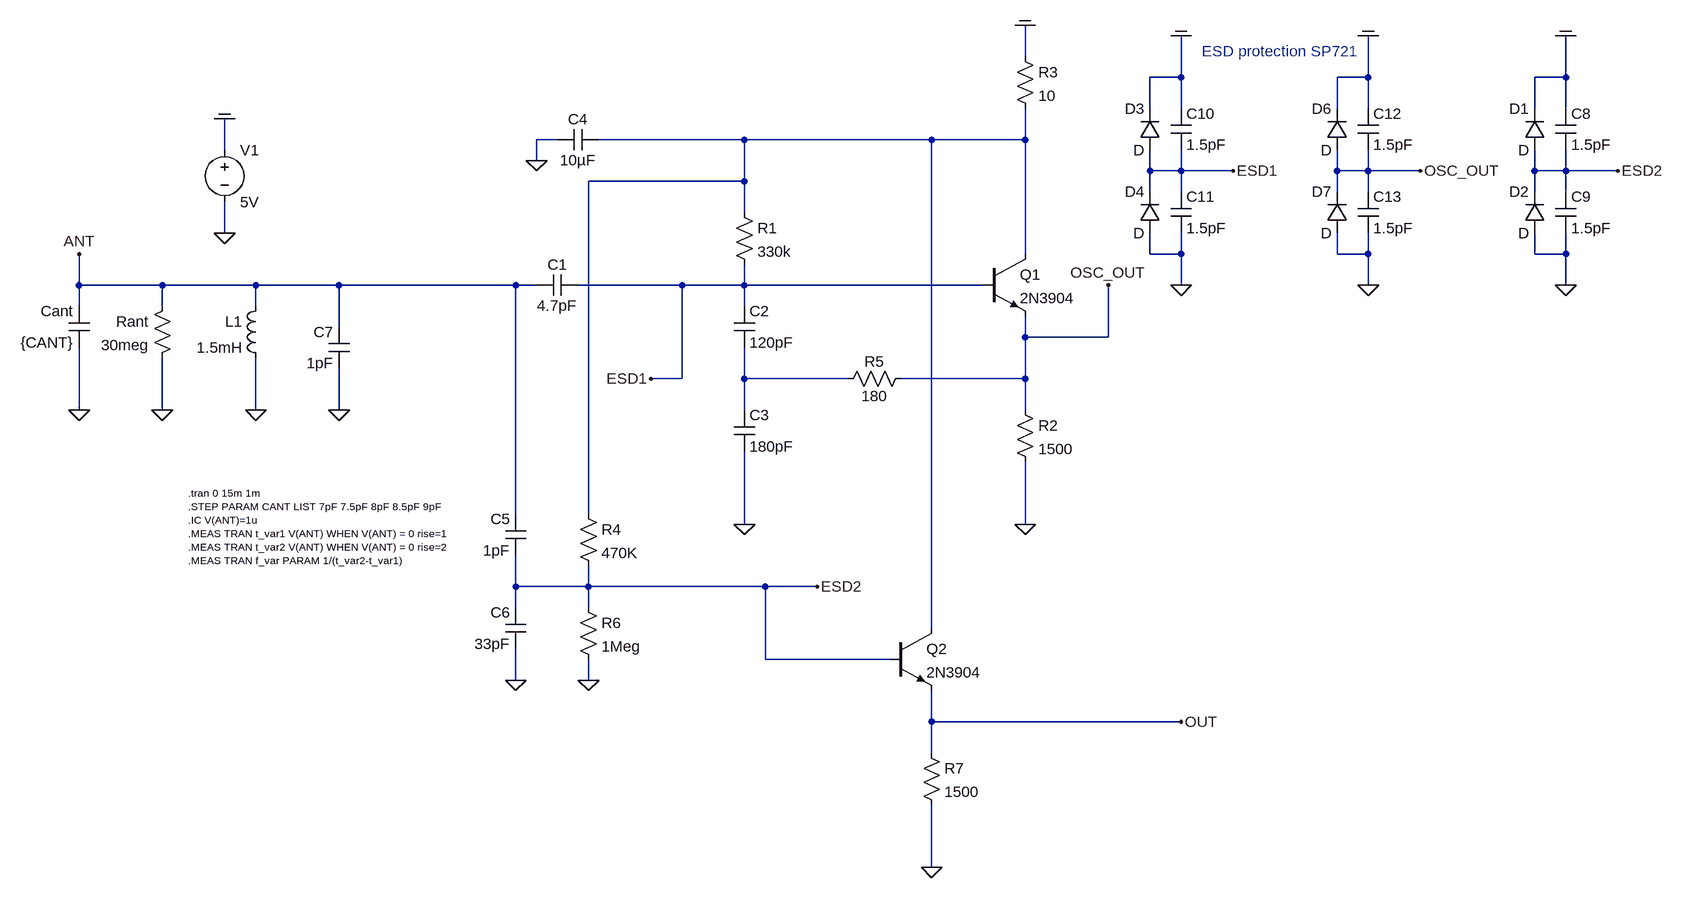
[diagram p0: schematic 2019_analog_oscill_sin_33v_v02.asc]
2019_analog_oscill_sin_33v_v02.asc, the LTspice schematic file:
Version 4
SHEET 1 2908 1508
WIRE 704 -160 704 -208
WIRE 944 -128 944 -192
WIRE 944 -128 896 -128
WIRE 1232 -128 1232 -192
WIRE 1232 -128 1184 -128
WIRE 1536 -128 1536 -192
WIRE 1536 -128 1488 -128
WIRE 896 -80 896 -128
WIRE 944 -80 944 -128
WIRE 1184 -80 1184 -128
WIRE 1232 -80 1232 -128
WIRE 1488 -80 1488 -128
WIRE 1536 -80 1536 -128
WIRE -16 -32 -48 -32
WIRE 272 -32 48 -32
WIRE 560 -32 272 -32
WIRE 704 -32 704 -80
WIRE 704 -32 560 -32
WIRE -528 -16 -528 -64
WIRE -48 0 -48 -32
WIRE 896 16 896 -16
WIRE 944 16 944 -16
WIRE 944 16 896 16
WIRE 1024 16 944 16
WIRE 1184 16 1184 -16
WIRE 1232 16 1232 -16
WIRE 1232 16 1184 16
WIRE 1312 16 1232 16
WIRE 1488 16 1488 -16
WIRE 1536 16 1536 -16
WIRE 1536 16 1488 16
WIRE 1616 16 1536 16
WIRE 272 32 272 -32
WIRE 272 32 32 32
WIRE 896 48 896 16
WIRE 944 48 944 16
WIRE 1184 48 1184 16
WIRE 1232 48 1232 16
WIRE 1488 48 1488 16
WIRE 1536 48 1536 16
WIRE 272 80 272 32
WIRE -528 112 -528 64
WIRE 704 144 704 -32
WIRE 896 144 896 112
WIRE 944 144 944 112
WIRE 944 144 896 144
WIRE 1184 144 1184 112
WIRE 1232 144 1232 112
WIRE 1232 144 1184 144
WIRE 1488 144 1488 112
WIRE 1536 144 1536 112
WIRE 1536 144 1488 144
WIRE -752 192 -752 144
WIRE -624 192 -752 192
WIRE -480 192 -624 192
WIRE -352 192 -480 192
WIRE -80 192 -352 192
WIRE -48 192 -80 192
WIRE 176 192 16 192
WIRE 272 192 272 160
WIRE 272 192 176 192
WIRE 640 192 272 192
WIRE 944 192 944 144
WIRE 1232 192 1232 144
WIRE 1536 192 1536 144
WIRE -752 224 -752 192
WIRE -624 224 -624 192
WIRE -480 224 -480 192
WIRE 272 224 272 192
WIRE -352 256 -352 192
WIRE 704 272 704 240
WIRE 832 272 832 192
WIRE 832 272 704 272
WIRE 176 336 176 192
WIRE 176 336 128 336
WIRE 272 336 272 288
WIRE 432 336 272 336
WIRE 704 336 704 272
WIRE 704 336 512 336
WIRE -752 384 -752 288
WIRE -624 384 -624 304
WIRE -480 384 -480 304
WIRE -352 384 -352 320
WIRE 272 384 272 336
WIRE 704 384 704 336
WIRE -80 544 -80 192
WIRE 32 544 32 32
WIRE 272 560 272 448
WIRE 704 560 704 464
WIRE -80 656 -80 608
WIRE 32 656 32 624
WIRE 32 656 -80 656
WIRE 304 656 32 656
WIRE 384 656 304 656
WIRE -80 688 -80 656
WIRE 32 688 32 656
WIRE 560 720 560 -32
WIRE 304 768 304 656
WIRE 496 768 304 768
WIRE -80 800 -80 752
WIRE 32 800 32 768
WIRE 560 864 560 816
WIRE 944 864 560 864
WIRE 560 912 560 864
WIRE 560 1088 560 992
FLAG -528 112 0
FLAG -752 384 0
FLAG -752 144 ANT
FLAG -480 384 0
FLAG 272 560 0
FLAG 704 560 0
FLAG -624 384 0
FLAG -48 0 0
FLAG 832 192 OSC_OUT
FLAG -528 -64 COM
FLAG 704 -208 COM
FLAG 944 192 0
FLAG 944 -192 COM
FLAG 1024 16 ESD1
FLAG 1232 192 0
FLAG 1232 -192 COM
FLAG 1312 16 OSC_OUT
FLAG 128 336 ESD1
FLAG 944 864 OUT
FLAG -80 800 0
FLAG 32 800 0
FLAG 560 1088 0
FLAG -352 384 0
FLAG 1536 192 0
FLAG 1536 -192 COM
FLAG 1616 16 ESD2
FLAG 384 656 ESD2
SYMBOL cap 256 224 R0
SYMATTR InstName C2
SYMATTR Value 120pF
SYMBOL res 256 64 R0
SYMATTR InstName R1
SYMATTR Value 330k
SYMBOL voltage -528 -32 R0
WINDOW 123 0 0 Left 2
WINDOW 39 0 0 Left 2
SYMATTR InstName V1
SYMATTR Value 5V
SYMBOL ind -464 208 M0
SYMATTR InstName L1
SYMATTR Value 1.5mH
SYMATTR SpiceLine Ipk=0.1 Rser=40 Rpar=9Meg Cpar=1.76pF
SYMBOL cap -736 224 M0
SYMATTR InstName Cant
SYMATTR Value {CANT}
SYMBOL cap -48 176 M90
WINDOW 0 0 32 VBottom 2
WINDOW 3 32 32 VTop 2
SYMATTR InstName C1
SYMATTR Value 4.7pF
SYMBOL npn 640 144 R0
SYMATTR InstName Q1
SYMATTR Value 2N3904
SYMBOL cap 256 384 R0
SYMATTR InstName C3
SYMATTR Value 180pF
SYMBOL res 688 368 R0
SYMATTR InstName R2
SYMATTR Value 1500
SYMBOL res -608 208 M0
SYMATTR InstName Rant
SYMATTR Value 30meg
SYMBOL cap 48 -48 R90
WINDOW 0 0 32 VBottom 2
WINDOW 3 32 32 VTop 2
SYMATTR InstName C4
SYMATTR Value 10µF
SYMBOL res 688 -176 R0
SYMATTR InstName R3
SYMATTR Value 10
SYMBOL res 528 320 R90
WINDOW 0 5 56 VBottom 2
WINDOW 3 27 56 VTop 2
SYMATTR InstName R5
SYMATTR Value 180
SYMBOL diode 912 -16 R180
WINDOW 0 24 64 Left 2
WINDOW 3 24 0 Left 2
SYMATTR InstName D3
SYMBOL diode 912 112 R180
WINDOW 0 24 64 Left 2
WINDOW 3 24 0 Left 2
SYMATTR InstName D4
SYMBOL cap 928 -80 R0
SYMATTR InstName C10
SYMATTR Value 1.5pF
SYMBOL cap 928 48 R0
SYMATTR InstName C11
SYMATTR Value 1.5pF
SYMBOL diode 1200 -16 R180
WINDOW 0 24 64 Left 2
WINDOW 3 24 0 Left 2
SYMATTR InstName D6
SYMBOL diode 1200 112 R180
WINDOW 0 24 64 Left 2
WINDOW 3 24 0 Left 2
SYMATTR InstName D7
SYMBOL cap 1216 -80 R0
SYMATTR InstName C12
SYMATTR Value 1.5pF
SYMBOL cap 1216 48 R0
SYMATTR InstName C13
SYMATTR Value 1.5pF
SYMBOL cap -64 544 M0
SYMATTR InstName C5
SYMATTR Value 1pF
SYMBOL cap -64 688 M0
SYMATTR InstName C6
SYMATTR Value 33pF
SYMBOL res 16 528 R0
SYMATTR InstName R4
SYMATTR Value 470K
SYMBOL res 16 672 R0
SYMATTR InstName R6
SYMATTR Value 1Meg
SYMBOL npn 496 720 R0
SYMATTR InstName Q2
SYMATTR Value 2N3904
SYMBOL res 544 896 R0
SYMATTR InstName R7
SYMATTR Value 1500
SYMBOL cap -336 256 M0
SYMATTR InstName C7
SYMATTR Value 1pF
SYMBOL diode 1504 -16 R180
WINDOW 0 24 64 Left 2
WINDOW 3 24 0 Left 2
SYMATTR InstName D1
SYMBOL diode 1504 112 R180
WINDOW 0 24 64 Left 2
WINDOW 3 24 0 Left 2
SYMATTR InstName D2
SYMBOL cap 1520 -80 R0
SYMATTR InstName C8
SYMATTR Value 1.5pF
SYMBOL cap 1520 48 R0
SYMATTR InstName C9
SYMATTR Value 1.5pF
TEXT -584 512 Left 1 !.tran 0 15m 1m\n.STEP PARAM CANT LIST 7pF 7.5pF 8pF 8.5pF 9pF\n.IC V(ANT)=1u\n.MEAS TRAN t_var1 V(ANT) WHEN V(ANT) = 0 rise=1\n.MEAS TRAN t_var2 V(ANT) WHEN V(ANT) = 0 rise=2\n.MEAS TRAN f_var PARAM 1/(t_var2-t_var1)
TEXT 976 -168 Left 2 ;ESD protection SP721

The netlist it stands for:
* 2019_analog_oscill_sin_33v_v02.asc
C2 ESD1 N002 120pF
R1 N001 ESD1 330k
V1 COM 0 5V
L1 ANT 0 1.5mH Ipk=0.1 Rser=40 Rpar=9Meg Cpar=1.76pF
Cant ANT 0 {CANT}
C1 ANT ESD1 4.7pF
Q1 N001 ESD1 OSC_OUT 0 2N3904
C3 N002 0 180pF
R2 OSC_OUT 0 1500
Rant ANT 0 30meg
C4 N001 0 10µF
R3 COM N001 10
R5 OSC_OUT N002 180
D3 ESD1 COM D
D4 0 ESD1 D
C10 COM ESD1 1.5pF
C11 ESD1 0 1.5pF
D6 OSC_OUT COM D
D7 0 OSC_OUT D
C12 COM OSC_OUT 1.5pF
C13 OSC_OUT 0 1.5pF
C5 ANT ESD2 1pF
C6 ESD2 0 33pF
R4 N001 ESD2 470K
R6 ESD2 0 1Meg
Q2 N001 ESD2 OUT 0 2N3904
R7 OUT 0 1500
C7 ANT 0 1pF
D1 ESD2 COM D
D2 0 ESD2 D
C8 COM ESD2 1.5pF
C9 ESD2 0 1.5pF
.model D D
.lib standard.dio
.model NPN NPN
.model PNP PNP
.lib standard.bjt
.tran 0 15m 1m
.STEP PARAM CANT LIST 7pF 7.5pF 8pF 8.5pF 9pF
.IC V(ANT)=1u
.MEAS TRAN t_var1 V(ANT) WHEN V(ANT) = 0 rise=1
.MEAS TRAN t_var2 V(ANT) WHEN V(ANT) = 0 rise=2
.MEAS TRAN f_var PARAM 1/(t_var2-t_var1)
* ESD protection SP721
.backanno
.end